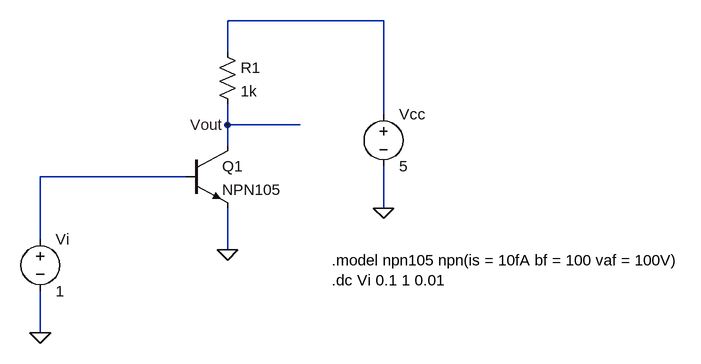
[diagram p0: schematic Draft9.asc]
Draft9.asc, the LTspice schematic file:
Version 4
SHEET 1 980 680
WIRE 496 64 256 64
WIRE 256 112 256 64
WIRE 496 208 496 64
WIRE 256 224 256 192
WIRE 368 224 256 224
WIRE 256 256 256 224
WIRE 192 304 -32 304
WIRE 496 352 496 288
WIRE -32 400 -32 304
WIRE 256 416 256 352
WIRE -32 544 -32 480
FLAG -32 544 0
FLAG 256 416 0
FLAG 496 352 0
FLAG 256 224 Vout
SYMBOL npn 192 256 R0
SYMATTR InstName Q1
SYMATTR Value NPN105
SYMBOL res 240 96 R0
SYMATTR InstName R1
SYMATTR Value 1k
SYMBOL voltage -32 384 R0
SYMATTR InstName Vi
SYMATTR Value 1
SYMATTR SpiceLine Rser=0
SYMBOL voltage 496 192 R0
SYMATTR InstName Vcc
SYMATTR Value 5
TEXT 416 432 Left 2 !.model npn105 npn(is = 10fA bf = 100 vaf = 100V)\n.dc Vi 0.1 1 0.01

The netlist it stands for:
* Draft9.asc
Q1 Vout N002 0 0 NPN105
R1 N001 Vout 1k
Vi N002 0 1 Rser=0
Vcc N001 0 5
.model NPN NPN
.model PNP PNP
.lib standard.bjt
.model npn105 npn(is = 10fA bf = 100 vaf = 100V)
.dc Vi 0.1 1 0.01
.backanno
.end